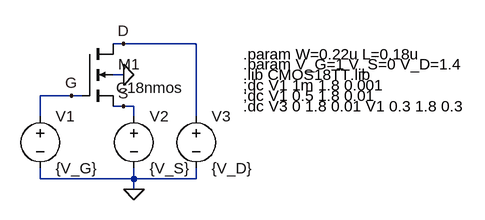
[diagram p0: schematic NMOS-DC-testbench.asc]
NMOS-DC-testbench.asc, the LTspice schematic file:
Version 4
SHEET 1 880 680
WIRE 96 80 80 80
WIRE 208 80 96 80
WIRE 96 128 80 128
WIRE 16 160 -32 160
WIRE 32 160 16 160
WIRE 96 176 80 176
WIRE 112 176 96 176
WIRE -32 192 -32 160
WIRE 112 192 112 176
WIRE 208 192 208 80
WIRE -32 288 -32 272
WIRE 112 288 112 272
WIRE 112 288 -32 288
WIRE 208 288 208 272
WIRE 208 288 112 288
WIRE 112 304 112 288
FLAG 112 304 0
FLAG 96 128 0
FLAG 16 160 G
FLAG 96 176 S
FLAG 96 80 D
SYMBOL nmos4 32 80 R0
WINDOW 3 53 68 Left 2
SYMATTR Value C18nmos
SYMATTR InstName M1
SYMATTR Value2 l={L} w={W}
SYMBOL voltage 112 176 R0
SYMATTR InstName V2
SYMATTR Value {V_S}
SYMBOL voltage -32 176 R0
SYMATTR InstName V1
SYMATTR Value {V_G}
SYMBOL voltage 208 176 R0
SYMATTR InstName V3
SYMATTR Value {V_D}
TEXT 280 96 Left 2 !.param W=0.22u L=0.18u
TEXT 280 112 Left 2 !.param V_G=1 V_S=0 V_D=1.4
TEXT 280 144 Left 2 !;dc V1 1m 1.8 0.001
TEXT 280 128 Left 2 !.lib CMOS18TT.lib
TEXT 280 160 Left 2 !;dc V1 0.5 1.8 0.01
TEXT 280 176 Left 2 !.dc V3 0 1.8 0.01 V1 0.3 1.8 0.3

The netlist it stands for:
* NMOS-DC-testbench.asc
M1 D G S 0 C18nmos l={L} w={W}
V2 S 0 {V_S}
V1 G 0 {V_G}
V3 D 0 {V_D}
.model NMOS NMOS
.model PMOS PMOS
.lib standard.mos
.param W=0.22u L=0.18u
.param V_G=1 V_S=0 V_D=1.4
;dc V1 1m 1.8 0.001
.lib CMOS18TT.lib
;dc V1 0.5 1.8 0.01
.dc V3 0 1.8 0.01 V1 0.3 1.8 0.3
.backanno
.end